# Altium schematic sheet SystemView.SchDoc
size A; SheetNumber: 1; SheetTotal: 3
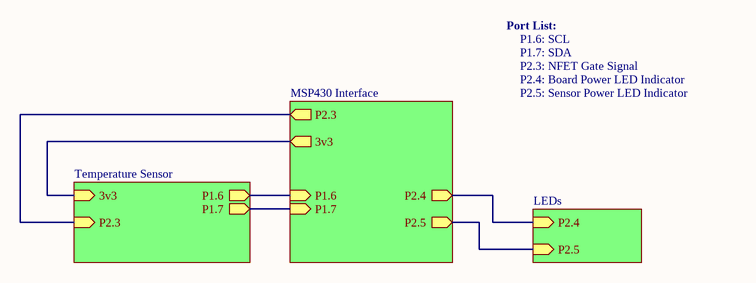
[diagram p0: SystemView.SchDoc]

## Sub-sheets
LEDs = StatusLEDs.SchDoc: P2.5 (in), P2.4 (in)
MSP430 Interface = LaunchPadHeader.SchDoc: 3v3 (out), P2.4 (out), P2.3 (out), P2.5 (out), P1.6 (in), P1.7 (in)
Temperature Sensor = TempSensor.SchDoc: P1.7 (out), P1.6 (out), 3v3 (in), P2.3 (in)

## Nets
(unnamed): sheet MSP430 Interface/3v3, sheet Temperature Sensor/3v3
(unnamed): sheet MSP430 Interface/P2.4, sheet LEDs/P2.4
(unnamed): sheet MSP430 Interface/P2.3, sheet Temperature Sensor/P2.3
(unnamed): sheet MSP430 Interface/P2.5, sheet LEDs/P2.5
(unnamed): sheet MSP430 Interface/P1.6, sheet Temperature Sensor/P1.6
(unnamed): sheet MSP430 Interface/P1.7, sheet Temperature Sensor/P1.7

## Notes on the sheet
- Port List:
- P1.6: SCL
- P1.7: SDA
- P2.3: NFET Gate Signal
- P2.4: Board Power LED Indicator
- P2.5: Sensor Power LED Indicator